# EAGLE board BMS (EAGLE 6.4), part 1 of 2
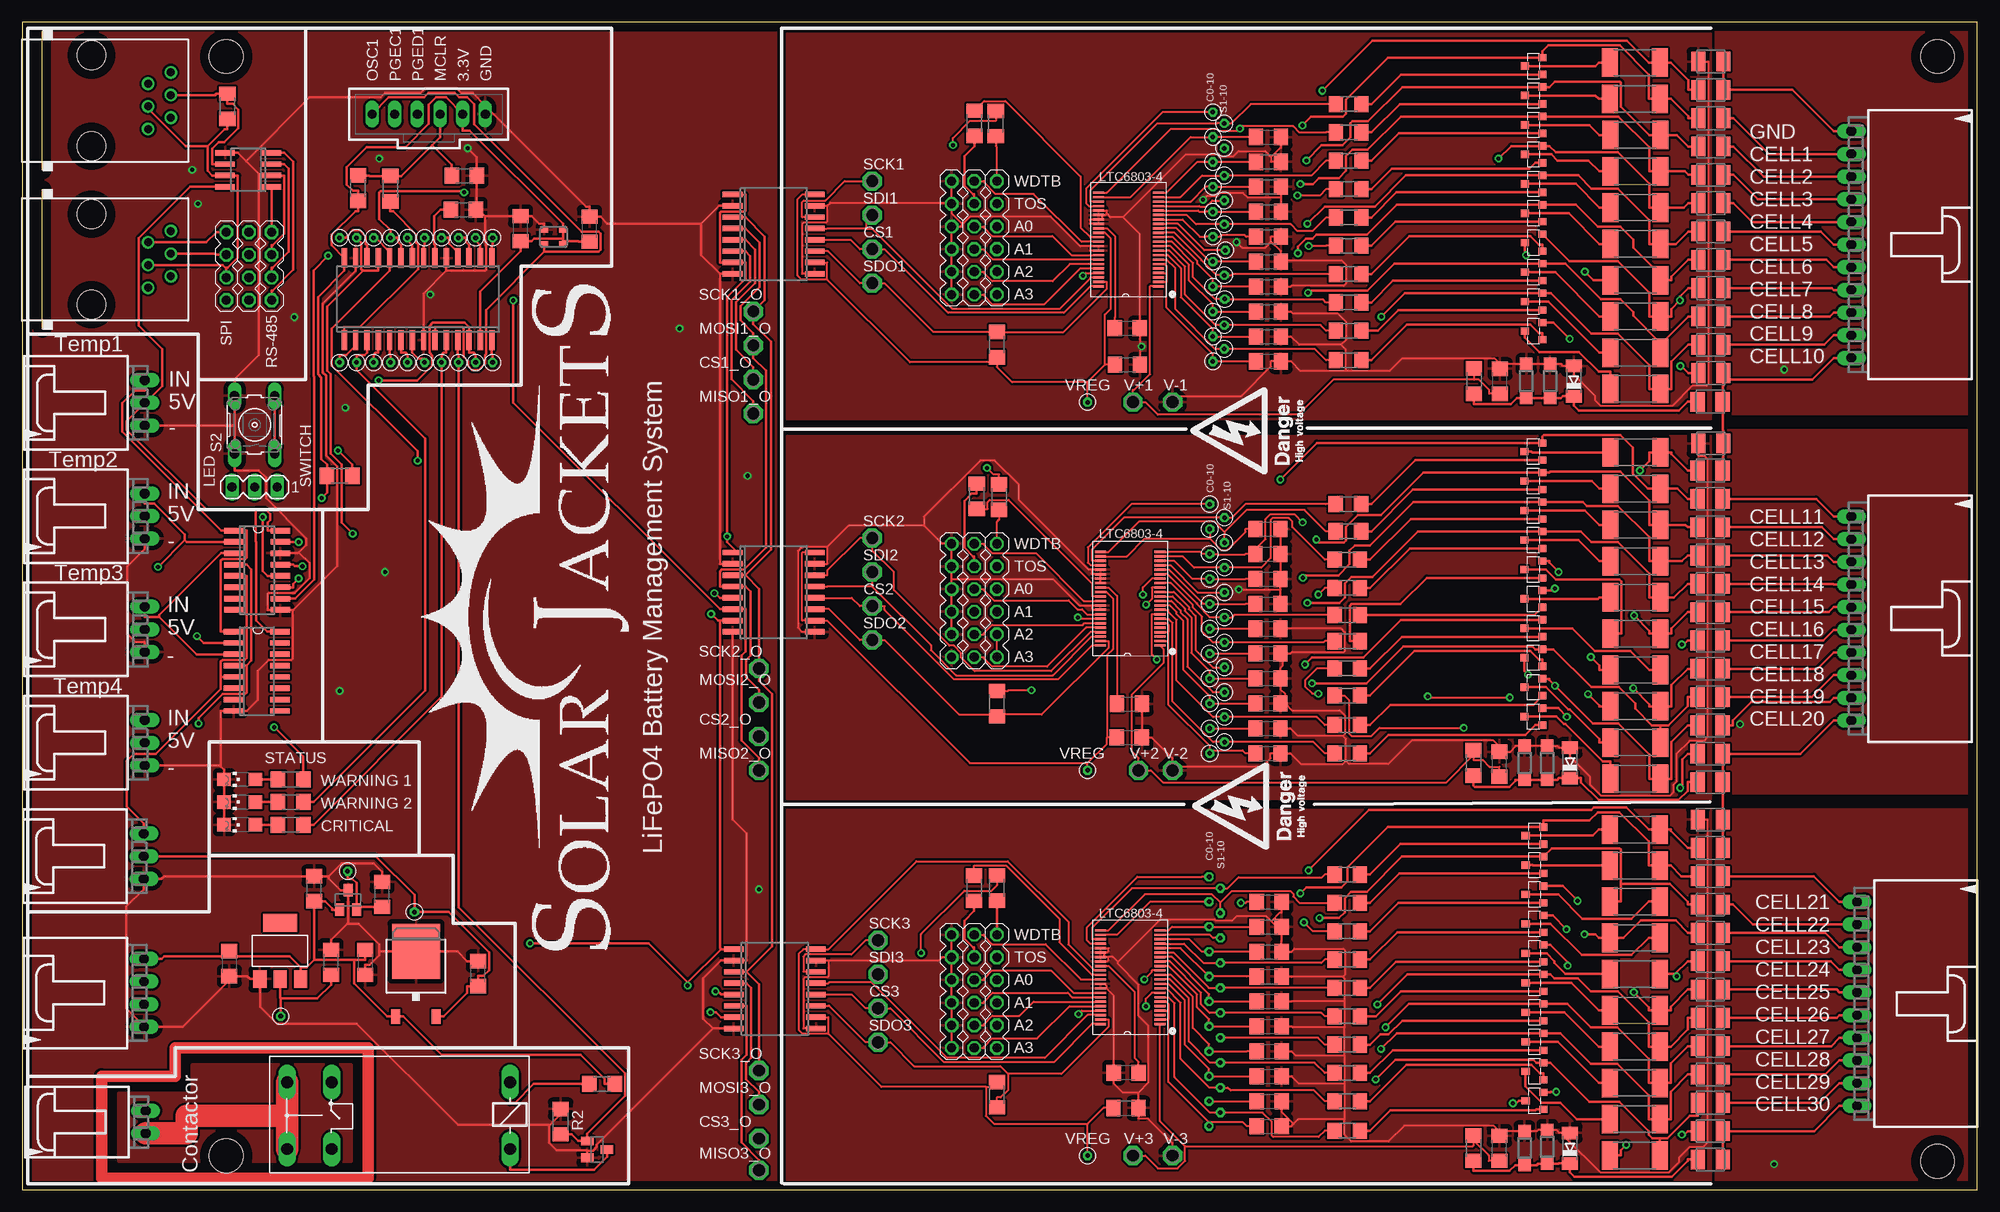
[diagram p10: board, top side]
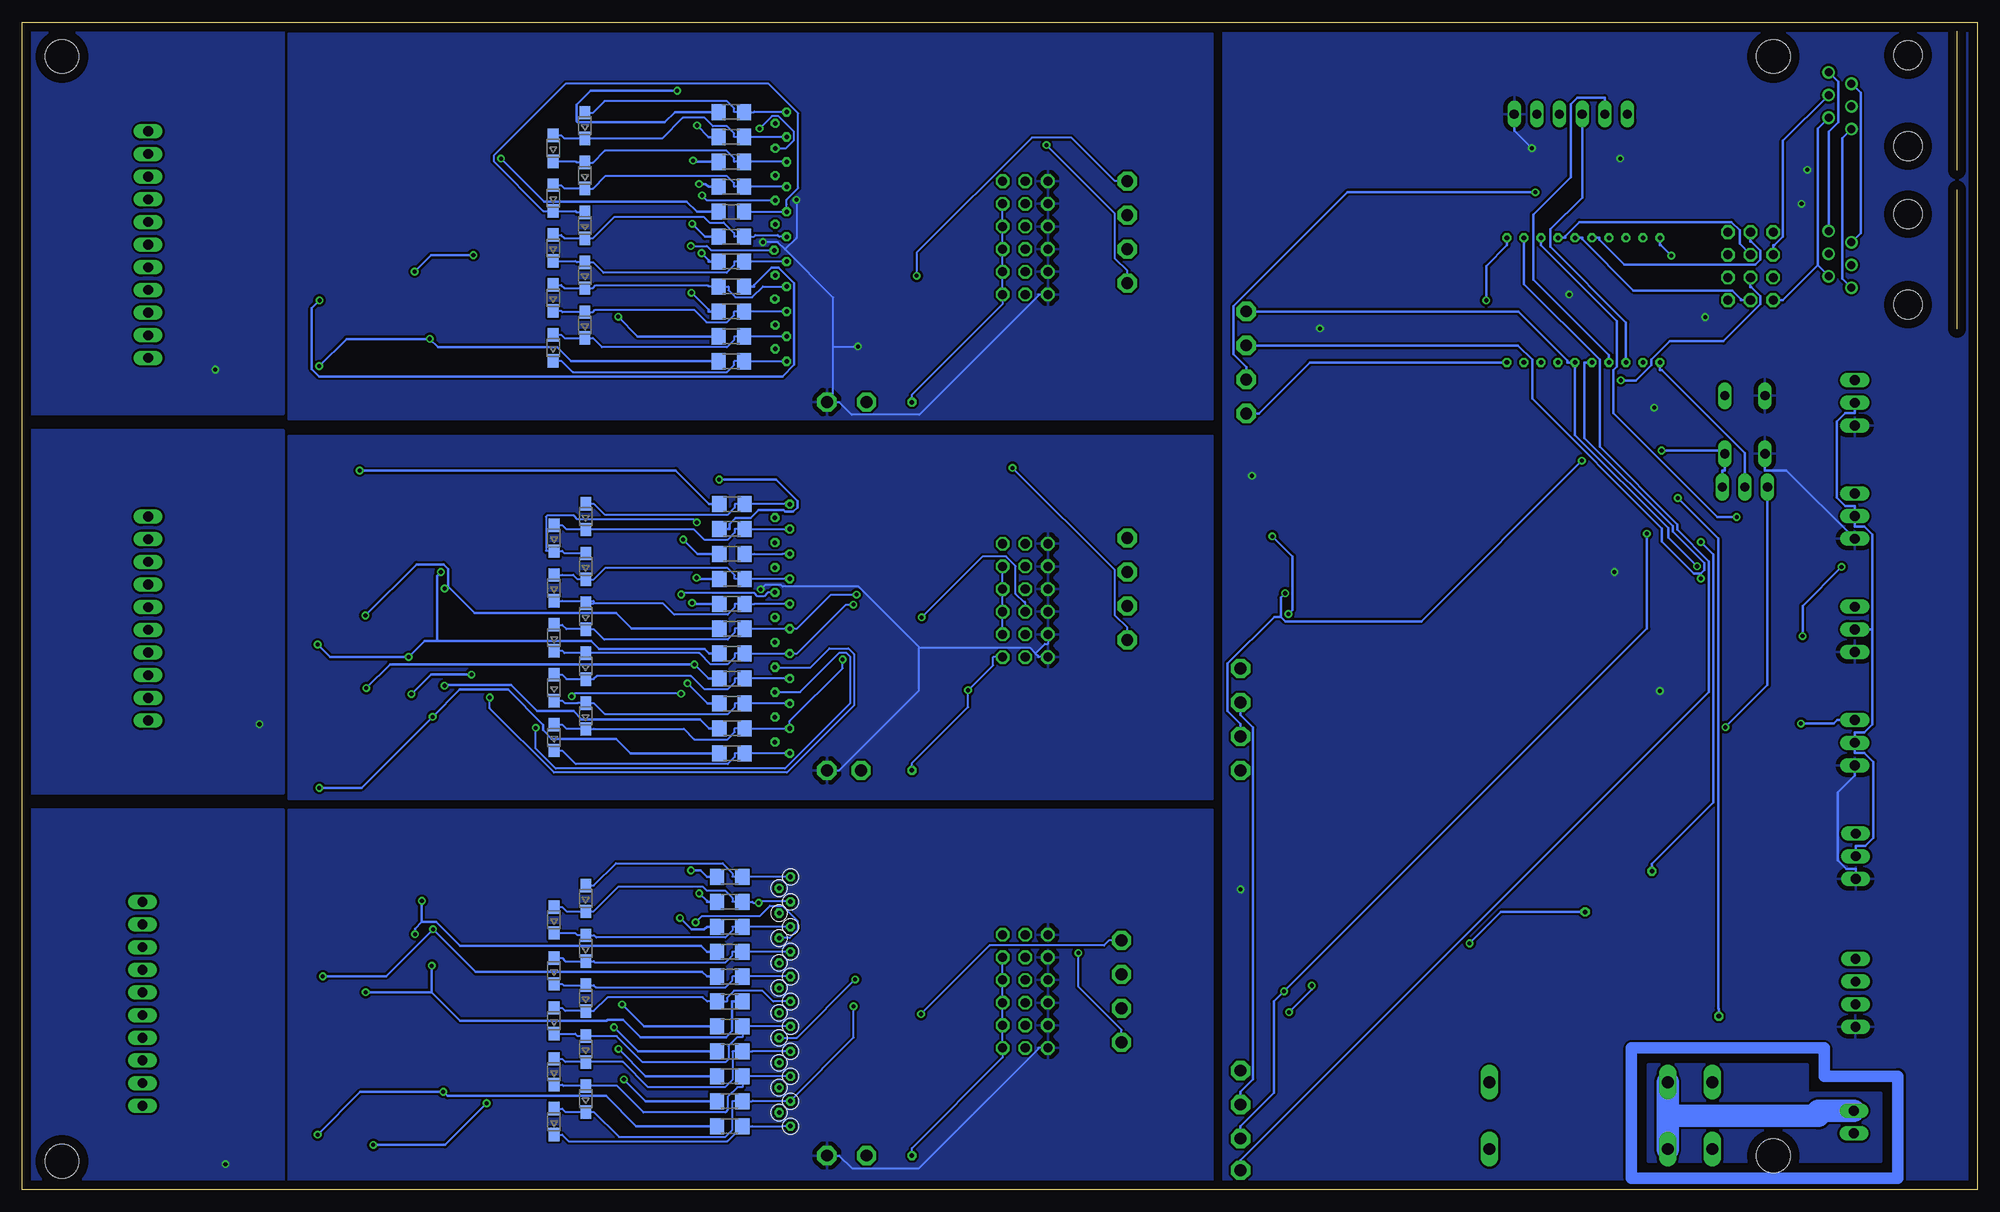
[diagram p11: board, bottom side, seen from below]

Size 219.07 x 130.84 mm. Coordinates in mm from the lower left corner, seen from the top.
Outline: 0,0 219.07,0 219.07,130.84 0,130.84 0,0
Copper layers (1*16): Top 0.035mm / dielectric 1.5mm / Bottom 0.035mm
Design rules "SJ Design Rules *": minimum track width 8mil, minimum drill 18mil, track to track 10mil, track to pad 8mil, pad to pad 8mil, via to via 10mil, smd to smd 8mil, copper to edge 40mil, drill to drill 10mil, minimum pad ring 10mil, minimum via ring 8mil, stop-mask expansion 4mil, vias tented up to drill 0mil, thermal gap 20mil
Net classes: 0 default: width 0.254 mm; 1 Mini: width 0.203 mm
Holes 3.81 mm at 214.63,127 214.63,3.17 22.86,3.81 22.86,127
tRestrict: 5 lines
bRestrict: 4 lines
vRestrict: area 130.3,38.6 to 144.2,47.5; area 130.8,80.2 to 143.8,89.8; area 67.9,62.5 to 68,63.2; area 67.8,62.5 to 67.9,63.4; area 67.7,62.5 to 67.8,63.6; area 67.7,62.5 to 67.7,63.7; area 67.6,62.5 to 67.7,63.8; area 67.5,62.5 to 67.6,63.9; area 67.4,62.5 to 67.5,64; area 67.3,62.5 to 67.4,64.1; area 67.3,62.5 to 67.3,64.2; area 67.2,62.5 to 67.3,63; 2520 more areas

## Footprints (pad centres in the part's own frame; a part is rotated, then mirrored left to right if it is on the bottom)
70553-04 = drill 1.092 long: 1 -3.81,-7.62; 2 -1.27,-7.62; 3 1.27,-7.62; 4 3.81,-7.62
70553-03 = drill 1.092 long: 1 -2.54,-7.62; 2 0,-7.62; 3 2.54,-7.62
C1206 = smd 1.6 x 1.8: 1 -1.4,0; 2 1.4,0
70553-10 = drill 1.092 long: 1 -11.43,-7.62; 2 -8.89,-7.62; 3 -6.35,-7.62; 4 -3.81,-7.62; 5 -1.27,-7.62; 6 1.27,-7.62; 7 3.81,-7.62; 8 6.35,-7.62; 9 8.89,-7.62; 10 11.43,-7.62
70553-02 = drill 1.092 long: 1 -1.27,-7.62; 2 1.27,-7.62
P1-13 = drill 1.321 pad 2.159 octagon: TP 0,0
SOD323-W = smd 1.5 x 1.2: A 1.45,0; C -1.45,0
MINIMELF = smd 1.4 x 1.8: A 1.7,0; C -1.7,0
SOD123 = smd 1.4 x 1.4: A 1.9,0; C -1.9,0
70553-11 = drill 1.092 long: 1 -12.7,-7.62; 2 -10.16,-7.62; 3 -7.62,-7.62; 4 -5.08,-7.62; 5 -2.54,-7.62; 6 0,-7.62; 7 2.54,-7.62; 8 5.08,-7.62; 9 7.62,-7.62; 10 10.16,-7.62; 11 12.7,-7.62
SO16W = smd 0.6 x 2.2: 1 -4.445,-4.6; 2 -3.175,-4.6; 3 -1.905,-4.6; 4 -0.635,-4.6; 5 0.635,-4.6; 6 1.905,-4.6; 7 3.175,-4.6; 8 4.445,-4.6; 9 4.445,4.6; 10 3.175,4.6; 11 1.905,4.6; 12 0.635,4.6; 13 -0.635,4.6; 14 -1.905,4.6; 15 -3.175,4.6; 16 -4.445,4.6
TO252 = smd 1 x 1.6: 1 -2.28,-4.8; 2 2.28,-4.8 | smd 5.4 x 6.2: 3 0,2.5
SOT223 = smd 1.499 x 2.007: 1 -2.261,-3.15; 2 0.025,-3.15; 3 2.311,-3.15 | smd 3.81 x 2.007: 4 0,3.15
RJ11-NO_SHIELD = drill 0.9 pad 1.4: 1 -3.175,8.89; 2 -1.905,6.35; 3 -0.635,8.89; 4 0.635,6.35; 5 1.905,8.89; 6 3.175,6.35 | hole 3.251: -5.08,0; 5.08,0
G2REA = drill 1.321 long: 1 -2.54,-3.683; 2 -2.54,3.81; P 17.45,-3.683; P@ 17.45,3.81; S 22.454,-3.683; S@ 22.454,3.81
L3225M = smd 1.6 x 2.2: 1 -1.4,0; 2 1.4,0
CHIPLED_1206 = smd 1.5 x 1.5: A 0,-1.75; C 0,1.75
SSOP44 = smd 0.25 x 1.25: P$1 -5.82,-3.33; P$2 -5.32,-3.33; P$3 -4.82,-3.33; P$4 -4.32,-3.33; P$5 -3.82,-3.33; P$6 -3.32,-3.33; P$7 -2.82,-3.33; P$8 -2.32,-3.33; P$9 -1.82,-3.33; P$10 -1.32,-3.33; P$11 -0.82,-3.33; P$12 -0.32,-3.33; P$13 0.18,-3.33; P$14 0.68,-3.33; P$15 1.18,-3.33; P$16 1.68,-3.33; P$17 2.18,-3.33; P$18 2.68,-3.33; P$19 3.18,-3.33; P$20 3.68,-3.33; P$21 4.18,-3.33; P$22 4.68,-3.33; P$23 4.68,3.37; P$24 4.18,3.37; P$25 3.68,3.37; P$26 3.18,3.37; P$27 2.68,3.37; P$28 2.18,3.37; P$29 1.68,3.37; P$30 1.18,3.37; P$31 0.68,3.37; P$32 0.18,3.37; P$33 -0.32,3.37; P$34 -0.82,3.37; P$35 -1.32,3.37; P$36 -1.82,3.37; P$37 -2.32,3.37; P$38 -2.82,3.37; P$39 -3.32,3.37; P$40 -3.82,3.37; P$41 -4.32,3.37; P$42 -4.82,3.37; P$43 -5.32,3.37; P$44 -5.82,3.37
20MIL = drill 0.508 octagon: P$1 0,0
70543-06 = drill 1.016 long: 1 -6.35,0; 2 -3.81,0; 3 -1.27,0; 4 1.27,0; 5 3.81,0; 6 6.35,0
MICRO3 = smd 0.8 x 0.9: 1 -0.95,-1; 2 0.95,-1; 3 0,1
R1206 = smd 1.6 x 1.803: 1 -1.422,0; 2 1.422,0
R2512 = smd 1.8 x 3.2: 1 -2.8,0; 2 2.8,0
B3F-10XX = drill 1.016 long: 1 -3.251,2.261; 2 3.251,2.261; 3 -3.251,-2.261; 4 3.251,-2.261
MA03-1 = drill 1.016 long: 1 -2.54,0; 2 0,0; 3 2.54,0
SOT23 = smd 1 x 1.4: 1 -0.95,-1.1; 2 0.95,-1.1; 3 0,1.1
SO16 = smd 0.6 x 2.2: 1 -4.445,-2.6; 2 -3.175,-2.6; 3 -1.905,-2.6; 4 -0.635,-2.6; 5 0.635,-2.6; 6 1.905,-2.6; 7 3.175,-2.6; 8 4.445,-2.6; 9 4.445,2.6; 10 3.175,2.6; 11 1.905,2.6; 12 0.635,2.6; 13 -0.635,2.6; 14 -1.905,2.6; 15 -3.175,2.6; 16 -4.445,2.6
SO28W = smd 0.6 x 2.2: 1 -8.255,-4.6; 2 -6.985,-4.6; 3 -5.715,-4.6; 4 -4.445,-4.6; 5 -3.175,-4.6; 6 -1.905,-4.6; 7 -0.635,-4.6; 8 0.635,-4.6; 9 1.905,-4.6; 10 3.175,-4.6; 11 4.445,-4.6; 12 5.715,-4.6; 13 6.985,-4.6; 14 8.255,-4.6; 15 8.255,4.6; 16 6.985,4.6; 17 5.715,4.6; 18 4.445,4.6; 19 3.175,4.6; 20 1.905,4.6; 21 0.635,4.6; 22 -0.635,4.6; 23 -1.905,4.6; 24 -3.175,4.6; 25 -4.445,4.6; 26 -5.715,4.6; 27 -6.985,4.6; 28 -8.255,4.6
ASE = smd 0.9 x 0.65: 1 -1.05,-0.825; 2 1.05,-0.825; 3 1.05,0.825; 4 -1.05,0.825
SO-08 = smd 0.6 x 2.2: 1 -1.905,-2.6; 2 -0.635,-2.6; 3 0.635,-2.6; 4 1.905,-2.6; 5 1.905,2.6; 6 0.635,2.6; 7 -0.635,2.6; 8 -1.905,2.6
3ROW_4POS = drill 1.016 octagon: 1 0,0; 2 2.54,0; 3 5.08,0; 4 0,-2.54; 5 2.54,-2.54; 6 5.08,-2.54; 7 0,-5.08; 8 2.54,-5.08; 9 5.08,-5.08; 10 0,-7.62; 11 2.54,-7.62; 12 5.08,-7.62
3ROW_6POS = drill 1.016 octagon: 1 0,0; 2 2.54,0; 3 5.08,0; 4 0,-2.54; 5 2.54,-2.54; 6 5.08,-2.54; 7 0,-5.08; 8 2.54,-5.08; 9 5.08,-5.08; 10 0,-7.62; 11 2.54,-7.62; 12 5.08,-7.62; 13 0,-10.16; 14 2.54,-10.16; 15 5.08,-10.16; 16 0,-12.7; 17 2.54,-12.7; 18 5.08,-12.7

## Placement (x,y rotation side)
12V  C-GRID-04-70553  [70553-04]  6.02,22.05 90 top
AIN0  C-GRID-03-70553  [70553-03]  6.1,88.19 90 top
AIN1  C-GRID-03-70553  [70553-03]  6.1,75.49 90 top
AIN2  C-GRID-03-70553  [70553-03]  6.1,62.79 90 top
AIN3  C-GRID-03-70553  [70553-03]  6.1,50.09 90 top
AIN4  C-GRID-03-70553  [70553-03]  5.99,37.36 90 top
C1  1uF  [C1206]  49.53,113.67 0 top
C2  1uF  [C1206]  123.85,92.46 0 top
C4  100nF 100V  [C1206]  139.65,92.84 0 top
C5  100nF 100V  [C1206]  139.65,95.63 0 top
C6  100nF 100V  [C1206]  139.65,98.42 0 top
C7  100nF 100V  [C1206]  139.65,101.22 0 top
C8  100nF 100V  [C1206]  139.65,104.01 0 top
C9  100nF 100V  [C1206]  139.65,106.81 0 top
C10  100nF 100V  [C1206]  139.65,109.6 0 top
C11  100nF 100V  [C1206]  139.65,112.39 0 top
C12  100nF 100V  [C1206]  139.65,115.19 0 top
C13  100nF 100V  [C1206]  139.65,117.98 0 top
C14  100nF 100V  [C1206]  165.61,90.6 90 top
C15  1uF  [C1206]  123.83,96.55 0 top
C16  .1uF  [C1206]  55.83,107.7 90 top
C19  100nF 100V  [C1206]  139.6,48.9 0 top
C20  100nF 100V  [C1206]  139.6,51.69 0 top
C21  100nF 100V  [C1206]  139.6,54.48 0 top
C22  4.7uF  [C1206]  49.43,109.86 0 top
C23  100nF 100V  [C1206]  139.6,57.28 0 top
C24  100nF 100V  [C1206]  139.6,60.07 0 top
C25  100nF 100V  [C1206]  139.6,62.87 0 top
C26  100nF 100V  [C1206]  139.6,65.66 0 top
C27  100nF 100V  [C1206]  139.6,68.45 0 top
C28  100nF 100V  [C1206]  139.6,71.25 0 top
C29  100nF 100V  [C1206]  139.6,74.04 0 top
C30  100nF 100V  [C1206]  165.53,47.68 90 top
C31  1uF  [C1206]  124.05,50.67 0 top
C32  1uF  [C1206]  124.08,54.46 0 top
C35  100nF 100V  [C1206]  139.73,7.11 0 top
C36  100nF 100V  [C1206]  139.73,9.91 0 top
C37  100nF 100V  [C1206]  139.73,12.7 0 top
C38  100nF 100V  [C1206]  139.73,15.49 0 top
C39  100nF 100V  [C1206]  139.73,18.29 0 top
C40  100nF 100V  [C1206]  139.73,21.08 0 top
C41  100nF 100V  [C1206]  139.73,23.88 0 top
C42  100nF 100V  [C1206]  139.73,26.67 0 top
C43  100nF 100V  [C1206]  139.73,29.46 0 top
C44  100nF 100V  [C1206]  139.73,32.26 0 top
C45  100nF 100V  [C1206]  165.53,4.62 90 top
C46  1uF  [C1206]  123.67,9.14 0 top
C47  1uF  [C1206]  123.7,13.11 180 top
C48  .1uF  [C1206]  63.55,107.65 90 top
C49  .1uF  [C1206]  40.31,33.1 90 top
C50  1uF  [C1206]  32.69,33.73 90 top
C51  1uF  [C1206]  23.19,25.32 270 top
C52  .1uF  [C1206]  34.59,25.48 90 top
C53  1uF  [C1206]  38.4,25.48 270 top
C54  .1uF  [C1206]  51.1,24.21 90 top
CELLS-11-20  C-GRID-10-70553  [70553-10]  212.6,64.01 270 top
CELLS-21-30  C-GRID-10-70553  [70553-10]  213.23,20.83 270 top
CONTACTOR  C-GRID-02-70553  [70553-02]  6.2,7.57 90 top
CS1  PTR1PAD1-13  [P1-13]  95.25,105.41 0 top
CS1_O  PTR1PAD1-13  [P1-13]  81.92,90.81 0 top
CS2  PTR1PAD1-13  [P1-13]  95.25,65.41 0 top
CS2_O  PTR1PAD1-13  [P1-13]  82.55,50.8 0 top
CS3  PTR1PAD1-13  [P1-13]  95.89,20.32 0 top
CS3_O  PTR1PAD1-13  [P1-13]  82.55,5.71 0 top
D4  PDZ7.5B  [SOD323-W]  159.49,50.67 90 bottom
D6  PDZ7.5B  [SOD323-W]  159.59,94.36 90 bottom
D7  PDZ7.5B  [SOD323-W]  156.03,96.9 90 bottom
D8  PDZ7.5B  [SOD323-W]  159.59,99.95 90 bottom
D9  PDZ7.5B  [SOD323-W]  156.03,102.49 90 bottom
D10  PDZ7.5B  [SOD323-W]  159.59,105.54 90 bottom
D11  PDZ7.5B  [SOD323-W]  156.03,108.08 90 bottom
D12  PDZ7.5B  [SOD323-W]  159.59,111.12 90 bottom
D13  PDZ7.5B  [SOD323-W]  156.03,113.67 90 bottom
D14  PDZ7.5B  [SOD323-W]  159.59,116.71 90 bottom
D15  PDZ7.5B  [SOD323-W]  156.03,119.25 90 bottom
D16  ZMM5265B-7  [MINIMELF]  173.86,90.63 90 top
D17  BAT46W  [SOD123]  171.2,90.63 90 top
D18  BAT46W  [SOD123]  168.53,90.63 90 top
D19  PDZ7.5B  [SOD323-W]  155.93,53.09 90 bottom
D20  PDZ7.5B  [SOD323-W]  159.49,56.26 90 bottom
D21  PDZ7.5B  [SOD323-W]  155.93,58.67 90 bottom
D22  PDZ7.5B  [SOD323-W]  159.49,61.85 90 bottom
D23  PDZ7.5B  [SOD323-W]  155.93,64.26 90 bottom
D24  PDZ7.5B  [SOD323-W]  159.49,67.44 90 bottom
D25  PDZ7.5B  [SOD323-W]  155.93,69.85 90 bottom
D26  PDZ7.5B  [SOD323-W]  159.49,73.03 90 bottom
D27  PDZ7.5B  [SOD323-W]  155.93,75.44 90 bottom
D28  ZMM5265B-7  [MINIMELF]  173.43,47.83 90 top
D29  BAT46W  [SOD123]  170.89,47.83 90 top
D30  BAT46W  [SOD123]  168.35,47.83 90 top
D33  PDZ7.5B  [SOD323-W]  159.49,7.62 90 bottom
D34  PDZ7.5B  [SOD323-W]  155.93,10.16 90 bottom
D35  PDZ7.5B  [SOD323-W]  159.49,13.21 90 bottom
D36  PDZ7.5B  [SOD323-W]  155.93,15.75 90 bottom
D37  PDZ7.5B  [SOD323-W]  159.49,18.92 90 bottom
D38  PDZ7.5B  [SOD323-W]  155.93,21.46 90 bottom
D39  PDZ7.5B  [SOD323-W]  159.49,24.51 90 bottom
D40  PDZ7.5B  [SOD323-W]  155.93,27.05 90 bottom
D41  PDZ7.5B  [SOD323-W]  159.49,30.23 90 bottom
D42  PDZ7.5B  [SOD323-W]  155.93,32.64 90 bottom
D43  ZMM5265B-7  [MINIMELF]  173.43,4.65 90 top
D44  BAT46W  [SOD123]  168.35,4.65 90 top
D45  BAT46W  [SOD123]  170.89,4.8 90 top
GND-10  C-GRID-11-70553  [70553-11]  212.6,105.92 270 top
IC1  ADUM1401  [SO16W]  84.2,107.09 270 top
IC2  7805DT  [TO252]  44.12,24.21 0 top
IC2_\  ADUM1401  [SO16W]  84.2,66.95 270 top
IC3  REG1117  [SOT223]  28.88,26.75 0 top
IC3_  ADUM1401  [SO16W]  84.33,22.5 270 top
J19  RJ11-2L-B  [RJ11-NO_SHIELD]  7.75,122.05 270 top
J20  RJ11-2L-B  [RJ11-NO_SHIELD]  7.75,104.27 270 top
K1  G2REA  [G2REA]  52.12,8.36 180 top
L5  IMC1210ER100K  [L3225M]  189.23,91.52 180 top
L6  IMC1210ER100K  [L3225M]  189.23,94.69 180 top
L7  IMC1210ER100K  [L3225M]  189.23,97.87 180 top
L8  IMC1210ER100K  [L3225M]  189.23,101.04 180 top
L9  IMC1210ER100K  [L3225M]  189.23,104.22 180 top
L10  IMC1210ER100K  [L3225M]  189.23,107.39 180 top
L11  IMC1210ER100K  [L3225M]  189.23,110.57 180 top
L12  IMC1210ER100K  [L3225M]  189.23,113.74 180 top
L13  IMC1210ER100K  [L3225M]  189.23,116.92 180 top
L14  IMC1210ER100K  [L3225M]  189.23,120.09 180 top
L15  IMC1210ER100K  [L3225M]  189.15,88.32 180 top
L16  IMC1210ER100K  [L3225M]  189.23,126.44 180 top
L17  IMC1210ER100K  [L3225M]  189.23,123.27 180 top
L18  IMC1210ER100K  [L3225M]  189.15,48.84 180 top
L19  IMC1210ER100K  [L3225M]  189.15,52.02 180 top
L20  IMC1210ER100K  [L3225M]  189.15,55.19 180 top
L21  IMC1210ER100K  [L3225M]  189.15,58.37 180 top
L22  IMC1210ER100K  [L3225M]  189.15,61.54 180 top
L23  IMC1210ER100K  [L3225M]  189.15,64.72 180 top
L24  IMC1210ER100K  [L3225M]  189.15,67.89 180 top
L25  IMC1210ER100K  [L3225M]  189.15,71.07 180 top
L26  IMC1210ER100K  [L3225M]  189.15,74.24 180 top
L27  IMC1210ER100K  [L3225M]  189.15,77.42 180 top
L28  IMC1210ER100K  [L3225M]  189.15,45.67 180 top
L29  IMC1210ER100K  [L3225M]  189.23,83.64 180 top
L30  IMC1210ER100K  [L3225M]  189.15,80.59 180 top
L33  IMC1210ER100K  [L3225M]  189.18,6.55 180 top
L34  IMC1210ER100K  [L3225M]  189.18,9.73 180 top
L35  IMC1210ER100K  [L3225M]  189.18,12.9 180 top
L36  IMC1210ER100K  [L3225M]  189.18,16.08 180 top
L37  IMC1210ER100K  [L3225M]  189.18,19.25 180 top
L38  IMC1210ER100K  [L3225M]  189.18,22.43 180 top
L39  IMC1210ER100K  [L3225M]  189.18,25.6 180 top
L40  IMC1210ER100K  [L3225M]  189.18,28.78 180 top
L41  IMC1210ER100K  [L3225M]  189.18,31.95 180 top
L42  IMC1210ER100K  [L3225M]  189.18,35.13 180 top
L43  IMC1210ER100K  [L3225M]  189.18,3.38 180 top
L44  IMC1210ER100K  [L3225M]  189.18,41.48 180 top
L45  IMC1210ER100K  [L3225M]  189.18,38.3 180 top
LED37  YELLOW  [CHIPLED_1206]  24.36,43.43 90 top
LED38  RED  [CHIPLED_1206]  24.36,40.89 90 top
LED40  YELLOW  [CHIPLED_1206]  24.36,45.97 90 top
LTC1  LTC6803-4  [SSOP44]  123.98,107.06 90 top
LTC1_C0  TESTPAD-20MIL  [20MIL]  133.43,120.78 90 top
LTC1_C1  TESTPAD-20MIL  [20MIL]  133.43,117.98 90 top
LTC1_C2  TESTPAD-20MIL  [20MIL]  133.43,115.19 90 top
LTC1_C3  TESTPAD-20MIL  [20MIL]  133.43,112.39 90 top
LTC1_C4  TESTPAD-20MIL  [20MIL]  133.43,109.6 90 top
LTC1_C5  TESTPAD-20MIL  [20MIL]  133.43,106.81 90 top
LTC1_C6  TESTPAD-20MIL  [20MIL]  133.43,104.01 90 top
LTC1_C7  TESTPAD-20MIL  [20MIL]  133.43,101.22 90 top
LTC1_C8  TESTPAD-20MIL  [20MIL]  133.43,98.42 90 top
LTC1_C9  TESTPAD-20MIL  [20MIL]  133.43,95.63 90 top
LTC1_C10  TESTPAD-20MIL  [20MIL]  133.43,92.84 90 top
LTC1_S1  TESTPAD-20MIL  [20MIL]  134.7,119.51 90 top
LTC1_S2  TESTPAD-20MIL  [20MIL]  134.7,116.71 90 top
LTC1_S3  TESTPAD-20MIL  [20MIL]  134.7,113.67 90 top
LTC1_S4  TESTPAD-20MIL  [20MIL]  134.7,110.87 90 top
LTC1_S5  TESTPAD-20MIL  [20MIL]  134.7,108.2 90 top
LTC1_S6  TESTPAD-20MIL  [20MIL]  134.82,105.28 90 top
LTC1_S7  TESTPAD-20MIL  [20MIL]  134.7,102.49 90 top
LTC1_S8  TESTPAD-20MIL  [20MIL]  134.75,99.82 90 top
LTC1_S9  TESTPAD-20MIL  [20MIL]  134.7,96.9 90 top
LTC1_S10  TESTPAD-20MIL  [20MIL]  134.7,94.23 90 top
LTC2  LTC6803-4  [SSOP44]  124.18,66.8 90 top
LTC2_C0  TESTPAD-20MIL  [20MIL]  133.07,76.83 90 top
LTC2_C1  TESTPAD-20MIL  [20MIL]  133.07,74.04 90 top
LTC2_C2  TESTPAD-20MIL  [20MIL]  133.07,71.25 90 top
LTC2_C3  TESTPAD-20MIL  [20MIL]  133.07,68.45 90 top
LTC2_C4  TESTPAD-20MIL  [20MIL]  133.07,65.66 90 top
LTC2_C5  TESTPAD-20MIL  [20MIL]  133.07,62.87 90 top
LTC2_C6  TESTPAD-20MIL  [20MIL]  133.07,60.07 90 top
LTC2_C7  TESTPAD-20MIL  [20MIL]  133.07,57.28 90 top
LTC2_C8  TESTPAD-20MIL  [20MIL]  133.07,54.48 90 top
LTC2_C9  TESTPAD-20MIL  [20MIL]  133.07,51.69 90 top
LTC2_C10  TESTPAD-20MIL  [20MIL]  133.07,48.9 90 top
LTC2_S1  TESTPAD-20MIL  [20MIL]  134.72,75.31 90 top
LTC2_S2  TESTPAD-20MIL  [20MIL]  134.72,72.52 90 top
LTC2_S3  TESTPAD-20MIL  [20MIL]  134.72,69.72 90 top
LTC2_S4  TESTPAD-20MIL  [20MIL]  134.72,66.93 90 top
LTC2_S5  TESTPAD-20MIL  [20MIL]  134.72,64.14 90 top
LTC2_S6  TESTPAD-20MIL  [20MIL]  134.72,61.34 90 top
LTC2_S7  TESTPAD-20MIL  [20MIL]  134.72,58.55 90 top
LTC2_S8  TESTPAD-20MIL  [20MIL]  134.72,55.75 90 top
LTC2_S9  TESTPAD-20MIL  [20MIL]  134.72,52.96 90 top
LTC2_S10  TESTPAD-20MIL  [20MIL]  134.72,50.16 90 top
LTC3  LTC6803-4  [SSOP44]  124.18,24.38 90 top
LTC3_C0  TESTPAD-20MIL  [20MIL]  132.99,35.05 90 bottom
LTC3_C1  TESTPAD-20MIL  [20MIL]  132.99,32.26 90 bottom
LTC3_C2  TESTPAD-20MIL  [20MIL]  132.99,29.46 90 bottom
LTC3_C3  TESTPAD-20MIL  [20MIL]  132.99,26.67 90 bottom
LTC3_C4  TESTPAD-20MIL  [20MIL]  132.99,23.88 90 bottom
LTC3_C5  TESTPAD-20MIL  [20MIL]  132.99,21.08 90 bottom
LTC3_C6  TESTPAD-20MIL  [20MIL]  132.99,18.29 90 bottom
LTC3_C7  TESTPAD-20MIL  [20MIL]  132.99,15.49 90 bottom
LTC3_C8  TESTPAD-20MIL  [20MIL]  132.99,12.7 90 bottom
LTC3_C9  TESTPAD-20MIL  [20MIL]  132.99,9.91 90 bottom
LTC3_C10  TESTPAD-20MIL  [20MIL]  132.99,7.11 90 bottom
LTC3_S1  TESTPAD-20MIL  [20MIL]  134.26,33.78 90 bottom
LTC3_S2  TESTPAD-20MIL  [20MIL]  134.26,30.99 90 bottom
LTC3_S3  TESTPAD-20MIL  [20MIL]  134.26,28.19 90 bottom
LTC3_S4  TESTPAD-20MIL  [20MIL]  134.26,25.4 90 bottom
LTC3_S5  TESTPAD-20MIL  [20MIL]  134.26,22.61 90 bottom
LTC3_S6  TESTPAD-20MIL  [20MIL]  134.26,19.81 90 bottom
LTC3_S7  TESTPAD-20MIL  [20MIL]  134.26,17.02 90 bottom
LTC3_S8  TESTPAD-20MIL  [20MIL]  134.26,14.22 90 bottom
LTC3_S9  TESTPAD-20MIL  [20MIL]  134.26,11.43 90 bottom
LTC3_S10  TESTPAD-20MIL  [20MIL]  134.26,8.64 90 bottom
MISO1_O  PTR1PAD1-13  [P1-13]  81.92,87 0 top
MISO2_O  PTR1PAD1-13  [P1-13]  82.55,46.99 0 top
MISO3_O  PTR1PAD1-13  [P1-13]  82.55,2.16 0 top
MOSI1_O  PTR1PAD1-13  [P1-13]  81.92,94.61 0 top
MOSI2_O  PTR1PAD1-13  [P1-13]  82.55,54.61 0 top
MOSI3_O  PTR1PAD1-13  [P1-13]  82.55,9.53 0 top
PROGRAM  C-GRID-06-70543  [70543-06]  45.54,120.55 0 top
Q3  SI2351DS  [MICRO3]  169.37,96.22 90 top
Q4  SI2351DS  [MICRO3]  169.37,99.52 90 top
Q5  SI2351DS  [MICRO3]  169.37,102.82 90 top
Q6  SI2351DS  [MICRO3]  169.37,106.12 90 top
Q7  SI2351DS  [MICRO3]  169.37,109.42 90 top
Q8  SI2351DS  [MICRO3]  169.37,112.73 90 top
Q9  SI2351DS  [MICRO3]  169.37,116.03 90 top
Q10  SI2351DS  [MICRO3]  169.37,119.33 90 top
Q11  SI2351DS  [MICRO3]  169.37,122.63 90 top
Q12  SI2351DS  [MICRO3]  169.37,125.93 90 top
Q15  SI2351DS  [MICRO3]  169.34,53.01 90 top
Q16  SI2351DS  [MICRO3]  169.34,56.31 90 top
Q17  SI2351DS  [MICRO3]  169.34,59.61 90 top
Q18  SI2351DS  [MICRO3]  169.34,62.92 90 top
Q19  SI2351DS  [MICRO3]  169.34,69.52 90 top
Q20  SI2351DS  [MICRO3]  169.34,66.22 90 top
Q21  SI2351DS  [MICRO3]  169.34,72.82 90 top
Q22  SI2351DS  [MICRO3]  169.34,76.12 90 top
Q23  SI2351DS  [MICRO3]  169.34,79.43 90 top
Q24  SI2351DS  [MICRO3]  169.34,82.73 90 top
Q27  SI2351DS  [MICRO3]  169.47,9.96 90 top
Q28  SI2351DS  [MICRO3]  169.47,13.26 90 top
Q29  SI2351DS  [MICRO3]  169.47,16.56 90 top
Q30  SI2351DS  [MICRO3]  169.47,19.86 90 top
Q31  SI2351DS  [MICRO3]  169.47,23.16 90 top
Q32  SI2351DS  [MICRO3]  169.47,26.47 90 top
Q33  SI2351DS  [MICRO3]  169.47,29.77 90 top
Q34  SI2351DS  [MICRO3]  169.47,33.07 90 top
Q35  SI2351DS  [MICRO3]  169.47,36.37 90 top
Q36  SI2351DS  [MICRO3]  169.47,39.67 90 top
R1  10K  [R1206]  35.56,80.01 180 top
R2  10K  [R1206]  60.33,7.62 270 top
R5  1M  [R1206]  106.71,119.51 270 top
R10  100 1%  [R1206]  139.62,92.84 0 bottom
R11  3.3K  [R1206]  148.64,92.96 180 top
R12  33 1W  [R2512]  180.77,89.74 180 top
R14  100 1%  [R1206]  139.62,95.63 0 bottom
R15  3.3K  [R1206]  148.64,96.27 180 top
R16  33 1W  [R2512]  180.77,93.8 180 top
R18  100 1%  [R1206]  139.62,98.42 0 bottom
R19  3.3K  [R1206]  148.64,99.44 180 top
R20  33 1W  [R2512]  180.77,97.87 180 top
R22  100 1%  [R1206]  139.62,101.22 180 bottom
R23  3.3K  [R1206]  148.64,102.62 180 top
R24  33 1W  [R2512]  180.77,101.93 180 top
R26  100 1%  [R1206]  139.62,104.01 0 bottom
R27  3.3K  [R1206]  148.64,105.79 180 top
R28  33 1W  [R2512]  180.77,105.99 180 top
R30  100 1%  [R1206]  139.62,106.81 0 bottom
R31  3.3K  [R1206]  148.64,108.97 180 top
R32  33 1W  [R2512]  180.77,110.06 180 top
R34  100 1%  [R1206]  139.62,109.6 0 bottom
R35  3.3K  [R1206]  148.64,112.14 180 top
R36  33 1W  [R2512]  180.77,114.12 180 top
R38  100 1%  [R1206]  139.62,112.39 0 bottom
R39  3.3K  [R1206]  148.64,115.32 180 top
R40  33 1W  [R2512]  180.77,118.19 180 top
R42  100 1%  [R1206]  139.62,115.19 0 bottom
R43  3.3K  [R1206]  148.64,118.49 180 top
R44  33 1W  [R2512]  180.72,122.25 180 top
R46  100 1%  [R1206]  139.62,117.98 0 bottom
R47  3.3K  [R1206]  148.64,121.67 180 top
R48  33 1W  [R2512]  180.72,126.31 180 top
R50  100  [R1206]  162.69,90.63 90 top
R51  100 1%  [R1206]  139.62,120.78 0 bottom
R52  10k\  [R1206]  37.62,112.24 90 top
R53  470  [R1206]  41.25,112.19 270 top
R62  100 1%  [R1206]  139.55,48.9 0 bottom
R63  3.3K  [R1206]  148.49,48.9 180 top
R64  33 1W  [R2512]  180.77,46.05 180 top
R66  100 1%  [R1206]  139.55,51.69 0 bottom
R67  3.3K  [R1206]  148.49,52.07 180 top
R68  33 1W  [R2512]  180.77,50.11 180 top
R70  100 1%  [R1206]  139.55,54.48 0 bottom
R71  3.3K  [R1206]  148.49,55.37 180 top
R72  33 1W  [R2512]  180.77,54.18 180 top
R74  100 1%  [R1206]  139.55,57.28 0 bottom
R75  3.3K  [R1206]  148.49,58.42 180 top
R76  33 1W  [R2512]  180.77,58.24 0 top
R78  100 1%  [R1206]  139.55,60.07 0 bottom
R79  3.3K  [R1206]  148.49,61.47 180 top
R80  33 1W  [R2512]  180.77,62.31 180 top
R82  100 1%  [R1206]  139.55,62.87 0 bottom
R83  3.3K  [R1206]  148.49,64.39 180 top
R84  33 1W  [R2512]  180.77,66.37 180 top
R86  100 1%  [R1206]  139.55,65.66 0 bottom
R87  3.3K  [R1206]  148.49,67.44 180 top
R88  33 1W  [R2512]  180.77,70.43 180 top
R90  100 1%  [R1206]  139.55,68.45 0 bottom
R91  3.3K  [R1206]  148.49,70.61 180 top
R92  33 1W  [R2512]  180.77,74.5 180 top
R94  100 1%  [R1206]  139.55,71.25 0 bottom
R95  3.3K  [R1206]  148.62,73.79 180 top
R96  33 1W  [R2512]  180.77,78.56 180 top
R98  100 1%  [R1206]  139.55,74.04 0 bottom
R99  3.3K  [R1206]  148.62,76.83 180 top
R100  33 1W  [R2512]  180.77,82.63 180 top
R102  100  [R1206]  162.64,47.83 90 top
R103  100 1%  [R1206]  139.55,76.83 0 bottom
R104  1M  [R1206]  106.96,77.72 90 top
R113  100 1%  [R1206]  139.8,7.11 0 bottom
R114  3.3K  [R1206]  148.49,6.6 180 top
R115  33 1W  [R2512]  180.7,3.84 180 top
R117  100 1%  [R1206]  139.8,9.91 0 bottom
R118  3.3K  [R1206]  148.49,9.91 180 top
R119  33 1W  [R2512]  180.7,7.9 180 top
R121  100 1%  [R1206]  139.8,12.7 0 bottom
R122  3.3K  [R1206]  148.49,13.08 180 top
R123  33 1W  [R2512]  180.7,11.96 180 top
R125  100 1%  [R1206]  139.8,15.49 0 bottom
R126  3.3K  [R1206]  148.49,16.26 180 top
R127  33 1W  [R2512]  180.7,16.03 180 top
R129  100 1%  [R1206]  139.8,18.29 0 bottom
R130  3.3K  [R1206]  148.49,19.43 180 top
R131  33 1W  [R2512]  180.7,20.09 180 top
R133  100 1%  [R1206]  139.8,21.08 180 bottom
R134  3.3K  [R1206]  148.49,22.61 180 top
R135  33 1W  [R2512]  180.7,24.16 180 top
R137  100 1%  [R1206]  139.8,23.88 0 bottom
R138  3.3K  [R1206]  148.49,25.78 180 top
R139  33 1W  [R2512]  180.7,28.22 0 top
R141  100 1%  [R1206]  139.8,26.67 0 bottom
R142  3.3K  [R1206]  148.49,28.96 180 top
R143  33 1W  [R2512]  180.7,32.28 0 top
R145  100 1%  [R1206]  139.8,29.46 0 bottom
R146  3.3K  [R1206]  148.49,32.13 180 top
R147  33 1W  [R2512]  180.7,36.32 180 top
R149  100 1%  [R1206]  139.8,32.26 0 bottom
R150  3.3K  [R1206]  148.49,35.31 180 top
R151  33 1W  [R2512]  180.7,40.36 180 top
R153  100  [R1206]  162.64,4.65 90 top
R154  100 1%  [R1206]  139.8,35.05 0 bottom
R155  1M  [R1206]  106.65,33.78 270 top
R156  62  [R1206]  30.07,40.89 0 top
R157  62  [R1206]  30.07,43.43 0 top
R158  62  [R1206]  30.07,45.97 0 top
R163  1M  [R1206]  109.22,10.64 270 top
R164  1M  [R1206]  109.22,33.81 90 top
R165  1M  [R1206]  109.22,54.46 270 top
R166  1M  [R1206]  109.47,77.62 90 top
R167  1M  [R1206]  109.22,94.72 90 top
R168  1M  [R1206]  109.09,119.48 90 top
R169  100  [R1206]  64.97,11.84 0 top
R170  120  [R1206]  22.99,121.41 270 top
S2  [B3F-10XX]  26.04,85.72 90 top
SCK1  PTR1PAD1-13  [P1-13]  95.25,113.03 0 top
SCK1_O  PTR1PAD1-13  [P1-13]  81.92,98.42 0 top
SCK2  PTR1PAD1-13  [P1-13]  95.25,73.03 0 top
SCK2_O  PTR1PAD1-13  [P1-13]  82.55,58.42 0 top
SCK3  PTR1PAD1-13  [P1-13]  95.89,27.94 0 top
SCK3_O  PTR1PAD1-13  [P1-13]  82.55,13.34 0 top
SDI1  PTR1PAD1-13  [P1-13]  95.25,109.22 0 top
SDI2  PTR1PAD1-13  [P1-13]  95.25,69.22 0 top
SDI3  PTR1PAD1-13  [P1-13]  95.89,24.13 0 top
SDO1  PTR1PAD1-13  [P1-13]  95.25,101.6 0 top
SDO2  PTR1PAD1-13  [P1-13]  95.25,61.59 0 top
SDO3  PTR1PAD1-13  [P1-13]  95.89,16.51 0 top
SV1  [MA03-1]  26.04,78.74 180 top
T1  PMV56XN  [SOT23]  64.41,4.5 270 top
U$1  SP720APP  [SO16]  26.29,58.09 270 top
U$2  PIC24HJ128GP-202  [SO28W]  44.35,99.82 0 top
U$3  ASE  [ASE]  59.54,106.78 180 top
U$4  MAX3440E  [SO-08]  25.32,114.3 90 top
U$5  3ROW_4POS  [3ROW_4POS]  22.86,107.31 0 top
U$6  MCP-3008  [SO16]  26.31,69.42 270 top
U$7  MAX6105  [SOT23]  36.5,32.46 0 top
U$8  3ROW_6POS  [3ROW_6POS]  104.14,113.03 0 top
U$9  3ROW_6POS  [3ROW_6POS]  104.14,72.39 0 top
U$10  3ROW_6POS  [3ROW_6POS]  104.14,28.57 0 top
U$11  TESTPAD-20MIL  [20MIL]  36.45,35.69 0 top
U$12  TESTPAD-20MIL  [20MIL]  28.96,19.43 0 top
U$13  TESTPAD-20MIL  [20MIL]  43.94,31.11 0 top
U$14  TESTPAD-20MIL  [20MIL]  35.56,92.71 0 top
U$15  TESTPAD-20MIL  [20MIL]  37.47,92.71 0 top
U$16  TESTPAD-20MIL  [20MIL]  39.37,92.71 90 top
U$17  TESTPAD-20MIL  [20MIL]  41.27,92.71 90 top
U$18  TESTPAD-20MIL  [20MIL]  43.18,92.71 90 top
U$19  TESTPAD-20MIL  [20MIL]  45.09,92.71 90 top
U$20  TESTPAD-20MIL  [20MIL]  46.99,92.71 90 top
U$21  TESTPAD-20MIL  [20MIL]  48.9,92.71 90 top
U$22  TESTPAD-20MIL  [20MIL]  50.8,92.71 90 top
U$23  TESTPAD-20MIL  [20MIL]  52.7,92.71 90 top
U$24  TESTPAD-20MIL  [20MIL]  52.7,106.68 90 top
U$25  TESTPAD-20MIL  [20MIL]  50.8,106.68 90 top
U$26  TESTPAD-20MIL  [20MIL]  48.9,106.68 90 top
U$27  TESTPAD-20MIL  [20MIL]  46.99,106.68 90 top
U$28  TESTPAD-20MIL  [20MIL]  45.09,106.68 90 top
U$29  TESTPAD-20MIL  [20MIL]  43.18,106.68 90 top
U$30  TESTPAD-20MIL  [20MIL]  41.27,106.68 90 top
U$31  TESTPAD-20MIL  [20MIL]  39.37,106.68 90 top
U$32  TESTPAD-20MIL  [20MIL]  37.47,106.68 90 top
U$33  TESTPAD-20MIL  [20MIL]  35.56,106.68 90 top
V+1  PTR1PAD1-13  [P1-13]  124.46,88.27 0 top
V+2  PTR1PAD1-13  [P1-13]  125.09,46.99 0 top
V+3  PTR1PAD1-13  [P1-13]  124.46,3.81 0 top
V-1  PTR1PAD1-13  [P1-13]  128.91,88.27 0 top
V-2  PTR1PAD1-13  [P1-13]  128.91,46.99 0 top
V-3  PTR1PAD1-13  [P1-13]  128.91,3.81 0 top
VREG1  TESTPAD-20MIL  [20MIL]  119.38,88.27 0 top
VREG2  TESTPAD-20MIL  [20MIL]  119.38,46.99 0 top
VREG3  TESTPAD-20MIL  [20MIL]  119.38,3.81 0 top

## Tracks (layer width: path | path; a pad name or v marks a point on that pad's centre or on a via)
12V
  Top 0.254: 31.19,24.93 29.96,26.16 23.19,26.16 | 32.69,25.75 31.87,24.93 31.19,24.93 | 32.69,25.75 | 32.69,25.75 37.17,25.75 | 32.69,25.75 32.69,31.2 C50.1 33.92,32.33 34.72,31.53 34.72,31.36 U$7.1 | IC3.3 31.19,24.93 | 12V.4 15.61,25.86 15.91,26.16 23.19,26.16 | C51.1 23.19,26.16 | R169.2 65.27,11.84 65.27,12.4 62.57,15.1 46.98,15.1 42.67,19.41 IC2.1 40.9,19.41 37.17,23.13 37.17,25.75 | 37.17,25.75 38.41,25.75 C53.1
+3V3  (via drill 0.46 pad 0.86)
  Top 0.254: v33.54,77.51 34.14,78.11 R1.2 34.14,81.24 33.51,81.86 33.51,91.03 33.16,91.39 33.16,100.05 36.09,102.99 U$2.28 34.68,105.84 34.68,107.03 37.34,109.69 37.62,109.69 R52.1 37.62,111.95 37.05,111.95 36.35,112.65 36.35,114.6 38.61,116.86 42.93,116.86 45.54,119.47 45.54,121.59 46.37,122.42 47.48,122.42 PROGRAM.5 49.35,118.69 50.16,118.69 60.59,108.26 U$3.1 60.59,106.95 60.59,106.61 | C48.1 62.32,106.25 62.28,106.28 60.59,106.28 | 60.59,106.61 57.38,106.61 57.06,106.3 C16.1 55.83,105.17 51.33,100.67 U$2.13 | 60.59,106.28 60.59,106.61 | U$3.4 60.59,106.28 | 28.96,21.42 28.91,21.47 IC3.2 | 28.96,21.42 33.07,21.42 34.59,22.95 C52.1 | 28.96,21.42 28.96,20.27 U$12.P$1
  Bottom 0.254: v33.54,77.51 29.02,72.99 29.02,20.33 28.96,20.27 U$12.P$1
+5V  (via drill 0.46 pad 0.86)
  Top 0.254: 74.57,23.23 v74.57,22.87 | 78.3,26.95 74.57,23.23 | v56.88,27.59 70.21,27.59 74.57,23.23 | 78.17,63.78 77.94,63.78 v77.2,64.53 | 78.3,26.95 78.17,27.08 78.17,63.78 | IC2_\.7 78.17,63.78 | IC2_\.1 80.18,71.4 79,72.58 v79,73.22 78.98,73.24 78.98,100.05 81.03,102.1 81.03,103.91 IC1.7 78.17,103.91 78.17,109.51 78.29,109.63 80.91,109.63 81.03,109.75 81.03,111.53 IC1.1 | AIN4.2 39.62,37.36 43.94,33.04 U$13.P$1 47.79,31.11 52.34,26.57 52.34,24.6 51.67,23.94 51.1,23.94 C54.1 49.87,22.81 49.87,22.05 47.23,19.41 IC2.2 | 26.14,76.2 26.14,72.64 26.19,72.6 26.19,63.81 27.46,62.53 U$1.16 | 13.72,88.15 11.71,86.14 11.71,85.16 20.66,76.2 26.14,76.2 | 26.14,76.2 27.28,76.2 27.77,75.71 27.77,75.04 27.48,74.76 27.48,73.86 U$6.16 | 13.72,88.15 13.72,88.1 15.69,90.08 15.69,94.22 13.06,96.86 13.06,106.67 18.79,112.39 21.29,112.39 U$4.8 | AIN0.2 13.72,88.15 | IC3_.7 78.3,19.33 77.75,19.88 v77.11,19.88 | IC3_.1 78.3,26.95
  Bottom 0.254: v79,73.22 76.74,70.96 76.74,64.99 v77.2,64.53 | U$13.P$1 53.36,31.11 v56.88,27.59 | v74.57,22.87 74.57,22.42 v77.11,19.88 | 11.75,62.79 11.75,52.13 12.64,51.24 13.72,51.24 AIN3.2 13.72,48.94 12.64,48.94 11.64,47.95 11.64,39.41 12.54,38.51 13.61,38.51 AIN4.2 | 11.75,62.79 11.75,73.45 12.64,74.34 13.72,74.34 AIN1.2 13.72,76.64 14.79,76.64 15.73,77.58 15.73,86.1 14.79,87.04 13.72,87.04 AIN0.2 | AIN2.2 11.75,62.79
ADC_CS  (via drill 0.46 pad 0.86)
  Top 0.254: v34.28,104.67 32.62,103.01 32.62,91.2 32.72,91.1 32.72,68.37 30.6,66.24 30.34,66.24 U$6.10 | U$2.26 38.63,105.85 38.5,105.98 38.5,106.83 37.8,107.53 37.04,107.53 36.4,106.89 36.4,106.68 U$33.P$1
  Bottom 0.254: U$33.P$1 35.56,105.84 35.45,105.84 v34.28,104.67
ADC_MISO  (via drill 0.46 pad 0.86)
  Top 0.254: v26.95,75.38 26.95,69.31 27.48,68.78 U$6.12 | U$26.P$1 49.73,106.68 49.73,106.18 50.06,105.85 U$2.17
  Bottom 0.254: U$26.P$1 48.9,105.84 40.38,97.32 40.38,92.25 40.76,91.87 40.76,87.04 29.1,75.38 v26.95,75.38
AGND  (via drill 0.46 pad 0.86)
  Top 0.203: 141,67.25 C27.2 C28.2 C29.2 | C26.2 141,67.25 | v136.33,67.28 136.36,67.25 141,67.25 | C25.2 147.82,62.87 148.23,62.45 148.23,60.39 148.11,60.26 142.29,60.26 142.1,60.07 141.25,60.07 | 128.91,47.45 139,47.45 139.89,48.34 139.89,48.9 C19.2 142.1,48.9 143.31,47.69 147.99,47.69 148.34,48.03 | 128.91,47.45 128.91,48.37 128.86,48.37 126.56,50.67 C31.2 125.45,53.23 125.48,53.25 C32.2 | V-2.TP 128.91,47.45 | 148.34,48.03 148.34,50.51 147.99,50.86 | 166.13,49.08 164.85,50.35 155.74,50.35 153.07,47.69 148.68,47.69 148.34,48.03 | 147.99,50.86 142.94,50.86 142.1,51.69 C20.2 | 141.53,54.48 142.29,53.72 147.64,53.72 148.23,53.14 148.23,51.09 147.99,50.86 | 166.13,49.08 166.74,49.08 167.35,49.69 167.35,49.73 D30.A D29.A 172.03,49.73 172.23,49.53 D28.A 173.43,48.52 175.7,46.25 175.7,45.37 176.94,44.13 184.61,44.13 185,44.53 185,45.35 185.37,45.72 185.37,48.81 186.86,50.31 188.43,50.31 188.86,50.74 188.86,81.85 188.47,82.24 187.83,82.24 L29.2 | C30.2 166.13,49.08 | 141.53,54.48 141.53,55.55 141,56.07 C23.2 141,58.48 141.25,58.73 141.25,60.07 | 104.14,68.42 115.51,68.42 118.44,65.48 119.88,65.48 | C21.2 141.53,54.48 | LTC2.P$27 120.72,69.48 119.88,69.48 | 119.88,69.48 119.51,69.48 111.68,77.31 111.68,79.02 108.97,81.74 107.37,81.74 101.05,75.41 101.05,74.41 | 119.88,69.48 119.88,68.98 LTC2.P$28 LTC2.P$29 LTC2.P$30 | 119.88,65.48 119.88,65.16 120.06,64.98 120.35,64.98 LTC2.P$36 | LTC2.P$35 119.88,65.48 | 90.21,72.01 90.21,70.13 IC2_\.15 | 101.05,74.41 92.61,74.41 90.21,72.01 | 90.21,72.01 87.32,72.01 86.92,71.6 86.92,62.99 87.4,62.51 IC2_\.9 | 101.05,74.41 103.07,72.39 U$9.1 U$9.4 104.14,68.42
  Top 0.203: C24.2 141.25,60.07 | 104.14,68.42 U$9.7 U$9.10 U$9.13
  Bottom 0.203: U$9.13 104.14,61.16 104.48,61.16 105.52,60.12 | 105.52,60.12 105.21,59.8 105.21,59.69 U$9.16 | 118.59,60.76 106.16,60.76 105.52,60.12 | 118.59,60.76 118.59,60.81 125.36,67.59 133.86,67.59 134.02,67.75 135.86,67.75 v136.33,67.28 | 118.59,60.76 118.59,55.92 127.52,46.99 V-2.TP
  pour Bottom: 85.72,43.81 85.72,84.45 189.23,84.45 189.23,43.81
  pour Top: 85.72,43.81 85.72,84.45 189.23,84.45 189.23,43.81
CELL0
  Top 0.254: GND-10.1 203.01,118.62 198.36,123.27 L17.1 L16.1
CELL1
  Top 0.254: L14.1 191.76,120.09 195.77,116.08 GND-10.2
CELL2
  Top 0.254: L13.1 191.76,116.92 195.14,113.54 GND-10.3
CELL3
  Top 0.254: L12.1 191.76,113.74 194.5,111 GND-10.4
CELL4
  Top 0.254: L11.1 191.76,110.57 193.87,108.46 GND-10.5
CELL5
  Top 0.254: GND-10.6 203.01,105.92 201.54,107.39 L10.1
CELL6
  Top 0.254: GND-10.7 203.01,103.38 202.17,104.22 L9.1
CELL7
  Top 0.254: GND-10.8 203.01,100.84 202.81,101.04 L8.1
CELL8
  Top 0.254: GND-10.9 203.01,98.3 202.58,97.87 L7.1
CELL9
  Top 0.254: GND-10.10 203.01,95.76 201.94,94.69 L6.1
CELL10
  Top 0.254: L30.1 190.55,82.03 190.63,82.1 L29.1 190.63,85.07 190.55,85.15 L15.1 190.55,90.01 190.63,90.09 190.63,90.8 | GND-10.11 203.01,93.22 200.59,90.8 190.63,90.8 | L5.1 190.63,90.8
CELL11
  Top 0.254: CELLS-11-20.1 203.01,75.44 201.03,77.42 L27.1
CELL12
  Top 0.254: CELLS-11-20.2 203.01,72.9 201.66,74.24 L26.1
CELL13
  Top 0.254: CELLS-11-20.3 203.01,70.36 202.3,71.07 L25.1
CELL14
  Top 0.254: CELLS-11-20.4 203.01,67.82 202.93,67.89 L24.1
CELL15
  Top 0.254: CELLS-11-20.5 203.01,65.28 202.45,64.72 L23.1
CELL16
  Top 0.254: CELLS-11-20.6 203.01,62.74 201.81,61.54 L22.1
CELL17
  Top 0.254: CELLS-11-20.7 203.01,60.2 201.18,58.37 L21.1
CELL18
  Top 0.254: CELLS-11-20.8 203.01,57.66 200.55,55.19 L20.1
CELL19
  Top 0.254: CELLS-11-20.9 203.01,55.12 202.53,54.64 193.74,54.64 191.68,52.58 191.68,52.02 L19.1
CELL20
  Top 0.254: L45.1 L44.1 190.58,44.21 190.55,44.24 L28.1 L18.1 199.28,48.84 203.01,52.58 CELLS-11-20.10
CELL21
  Top 0.254: CELLS-21-30.1 203.64,32.26 200.77,35.13 L42.1
CELL22
  Top 0.254: L41.1 191.71,31.95 193.94,29.72 CELLS-21-30.2
CELL23
  Top 0.254: CELLS-21-30.3 203.64,27.18 202.04,28.78 L40.1
CELL24
  Top 0.254: CELLS-21-30.4 203.64,24.64 202.68,25.6 L39.1
CELL25
  Top 0.254: CELLS-21-30.5 203.64,22.1 203.31,22.43 L38.1
CELL26
  Top 0.254: CELLS-21-30.6 203.64,19.56 203.34,19.25 L37.1
CELL27
  Top 0.254: CELLS-21-30.7 203.64,17.02 202.7,16.08 L36.1
CELL28
  Top 0.254: CELLS-21-30.8 203.64,14.48 202.07,12.9 L35.1
CELL29
  Top 0.254: CELLS-21-30.9 203.64,11.94 201.44,9.73 L34.1
CELL30
  Top 0.254: CELLS-21-30.10 203.64,9.4 200.8,6.55 L33.1 L43.1
CRITICAL
  Top 0.254: R156.2 32.63,40.89 46.99,55.26 46.99,91.87 U$20.P$1 46.99,93.13 46.99,93.55 47.23,93.79 47.52,93.79 U$2.10
DI-RO  (via drill 0.46 pad 0.86)
  Top 0.254: v39.95,90.7 44.27,90.7 45.95,92.38 45.95,93.5 45.62,93.83 45.62,96.78 46,97.16 49.55,97.16 50.06,96.65 U$2.12 50.06,93.79 50.56,93.79 50.8,93.55 U$22.P$1
  Bottom 0.254: v39.95,90.7 38.24,90.7 36.51,92.43 36.51,93 34.43,95.08 28.45,95.08 24.29,99.25 24.29,100.14 25.29,101.14 25.4,101.14 U$5.8
FAULT
  Top 0.254: U$2.22 43.71,105.85 43.18,106.39 U$29.P$1
  Bottom 0.254: U$5.2 25.4,106.22 25.29,106.22 24.3,105.24 24.3,104.26 24.88,103.68 39.55,103.68 42.34,106.47 42.34,106.68 U$29.P$1
GND  (via drill 0.46 pad 0.86)
  Top 0.203: IC1.9 87.4,102.64 87.4,108.19 87.59,108.39 90.09,108.39 90.21,108.5 90.21,110.26 | 90.21,110.26 90.09,110.26 IC1.15 | 90.21,110.26 | C6.2 142.15,98.42 142.34,98.23 147.4,98.23 148.32,97.31 148.32,95.24 147.78,94.69 | 147.78,94.69 143.09,94.69 142.15,95.63 C5.2 | 148.33,91.76 148.33,94.14 147.78,94.69 | 148.33,91.76 143.23,91.76 142.15,92.84 C4.2 140.83,92.84 139.94,92.84 139.94,92.28 136.62,88.96 128.91,88.96 V-1.TP | 165.61,92.55 165.01,93.15 154.63,93.15 153.23,91.76 148.33,91.76 | 165.61,92.55 167.5,92.55 167.52,92.53 D18.A D17.A 172.46,92.53 172.66,92.33 D16.A 173.86,91.32 176.26,88.93 176.26,88.46 176.88,87.83 184.89,87.83 187.17,90.11 188.77,90.11 188.94,90.27 188.94,126.44 L16.2 | C7.2 142.15,101.22 142.24,101.31 148.1,101.31 148.32,101.53 148.32,103.69 147.84,104.17 141.05,104.17 | 125.25,94.5 C2.2 | 125.25,94.5 125.25,95.31 125.22,95.34 C15.2 125.22,107.11 123.35,108.99 | v125.43,94.5 125.25,94.5 | C11.2 141.05,111.19 | C12.2 139.94,115.19 139.94,115.74 | C8.2 141.05,104.17 | 141.05,104.17 141.05,104.21 141.05,105.22 140.98,105.22 139.94,106.25 | 105.36,108.21 105.21,108.06 105.21,107.95 U$8.7 U$8.10 U$8.13 U$8.16 | 119.68,105.74 118.56,105.74 115.23,109.06 106.21,109.06 105.36,108.21 | 105.36,108.21 104.14,109.42 U$8.4 104.14,110.62 | 90.21,110.26 90.57,110.62 104.14,110.62 | C14.2 165.61,92.55 | 141.05,111.19 C10.2 | 141.05,111.19 137.32,111.19 136.81,111.71 134.07,111.71 133.69,111.33 132.72,111.33 v132.32,110.94 | 139.94,106.25 139.94,106.81 C9.2 | v136.08,106.2 136.68,105.6 139.29,105.6 139.94,106.25 | 123.35,108.99 130.4,116.05 134.03,116.05 134.23,115.85 135.74,115.85 136.29,116.39 139.29,116.39 139.94,115.74
  Top 0.203: 139.94,115.74 140.98,116.78 141.05,116.78 C13.2 | LTC1.P$30 119.68,108.24 119.68,108.74 LTC1.P$29 121.07,108.74 121.07,109.24 | 121.54,109.42 121.54,109.74 LTC1.P$27 | 121.07,109.24 121.36,109.24 121.54,109.42 | 123.35,108.99 121.97,108.99 121.54,109.42 | LTC1.P$28 121.07,109.24 | 119.68,105.74 119.68,105.24 LTC1.P$36 | LTC1.P$35 119.68,105.74 | 104.14,110.62 U$8.1
  Bottom 0.203: 128.21,94.5 128.21,100 133.6,105.39 | 128.21,88.27 128.21,94.5 | 128.21,94.5 v125.43,94.5 | 133.6,105.39 134.42,106.2 v136.08,106.2 | v132.32,110.94 132.32,106.67 133.6,105.39 | 128.21,88.27 127.52,88.27 126.12,86.86 118.54,86.86 105.21,100.2 105.21,100.33 U$8.16 | V-1.TP 128.21,88.27
  pour Top: 85.72,86.36 85.72,129.54 189.23,129.54 189.23,86.36
  pour Bottom: 85.72,86.36 85.72,129.54 189.23,129.54 189.23,86.36
GNDIO  (via drill 0.46 pad 0.86)
  Top 0.254: 47.52,102.99 44.98,100.45 U$2.8 | 51.85,109.1 51.85,106.33 51.96,106.22 51.96,103.1 51.85,102.99 47.52,102.99 | 50.93,109.86 51.09,109.86 51.85,109.1 | 51.85,109.1 54.6,109.1 C16.2 57.06,109.1 57.89,108.26 58.49,108.26 U$3.2 | U$2.19 47.52,102.99 | C22.2 50.93,109.86 | 50.93,109.86 50.93,112.44 C1.2 50.93,115.69 v49.9,116.73 | 34.34,35.13 35.77,36.56 39.38,36.56 40.31,35.63 C49.2 | 30.98,71.43 32.2,70.2 32.2,68.57 30.51,66.87 27.6,66.87 27.48,66.75 27.48,64.97 U$6.9 30.2,64.97 30.32,64.97 | 30.98,71.43 30.88,71.32 30.34,71.32 U$6.14 | 30.98,71.43 31.82,72.27 31.82,72.98 27.3,77.5 27.3,79.78 26.47,80.62 23.77,80.62 S2.1 23.77,85.65 | 39.99,26.71 39.99,26.28 38.92,25.21 38.41,25.21 C53.2 | 36.5,29.79 37.7,29.79 39.99,27.5 39.99,26.71 | 39.99,26.71 41.09,26.71 IC2.3 48.77,26.71 49.87,25.61 C54.2 | 77.39,18.06 76.3,19.14 76.3,23.68 78.3,25.68 IC3_.2 81.16,25.68 81.16,39.93 79.6,41.49 IC2_\.8 | 77.39,18.06 78.3,18.06 IC3_.8 | 63.31,4.38 63.94,4.38 64.34,4.78 64.34,5.02 77.39,18.06 | 30.32,64.97 30.32,59.56 30.13,59.36 27.62,59.36 26.37,58.11 26.37,54.9 25.12,53.65 U$1.8 22.26,53.65 22.26,47.55 | 30.32,64.97 30.34,64.97 35.27,69.9 35.27,81.06 34.04,82.28 34.04,91.22 33.67,91.59 33.67,99.3 37.36,102.99 U$2.27 | 78.17,102.64 78.17,70.13 IC2_\.2 | 34.34,35.13 C50.2 15.89,35.13 15.58,34.82 AIN4.1 13.61,33.67 11.66,31.72 11.66,20.31 13.73,18.24 13.87,18.24 | 34.34,35.13 34.34,34.89 35.67,33.56 U$7.3 36.5,29.79 | 51.89,121.48 50.44,122.93 49.17,122.93 48.66,123.44 45.12,123.44 44.61,122.93 40.68,122.93 40.17,122.42 32.21,122.42 25.07,115.28 | 25.07,115.28 26.49,113.87 26.49,93.55 23.77,90.83 S2.2 23.77,85.65
  Top 0.254: 25.07,115.28 24.15,116.2 U$4.5 | LED38.C LED37.C LED40.C 22.61,47.05 22.26,47.4 22.26,47.55 | 36.5,29.79 36.38,29.79 34.59,28.01 C52.2 | 23.65,23.92 25.21,23.92 25.54,23.6 IC3.1 26.67,23.55 26.67,20.5 28.57,18.59 37.49,18.59 48.84,7.24 58.98,7.24 59.05,7.16 | 13.87,18.24 17.97,18.24 23.65,23.92 | AIN2.1 13.72,61.4 12.64,61.4 11.74,62.29 11.74,69.83 13.72,71.8 AIN1.1 | 76.08,108.28 76.08,104.73 78.17,102.64 | 76.08,108.28 78.07,110.26 IC1.2 | 76.08,108.28 65.55,108.28 64.78,109.05 C48.2 63.55,110.17 63.19,110.17 51.89,121.48 | PROGRAM.6 51.89,121.48 | 22.26,47.55 15.69,47.55 AIN3.1 | T1.2 63.31,4.38 | 13.87,18.24 12V.1 | IC1.8 78.17,102.64 | C51.2 23.65,23.92 | 23.77,85.65 15.69,85.65 AIN0.1 | 59.05,7.16 60.27,8.38 60.27,8.99 R2.1 | 59.05,7.16 59.05,5.26 59.89,4.42 63.25,4.42 63.31,4.38
  Bottom 0.254: AIN3.1 13.72,46.4 15.62,44.49 15.62,36.9 14.69,35.97 13.61,35.97 AIN4.1 | PROGRAM.6 51.89,118.69 51.86,118.69 v49.9,116.73 | S2.1 23.77,80.62 21.39,80.62 AIN1.1
  other vias: 40.64,69.22 35.56,55.88 36.2,87.63 73.66,96.52 19.05,114.3 30.48,97.79 45.72,100.33 40.01,115.57 19.68,110.49 81.28,80.01 82.55,33.66
  pour Top: 0.64,130.18 84.45,130.18 84.45,0.64 0.64,0.64
  pour Bottom: 0.64,130.18 84.45,130.18 84.45,0.64 0.64,0.64
JACK2
  Top 0.254: U$5.1 21.77,107.31 20.62,106.17 J20.2
  Bottom 0.254: J20.2 13.06,107.21 13.06,122.92 J19.2
JACK3
  Top 0.254: J19.3 21.6,122.68 21.75,122.83 R170.1 22.99,121.7 23.55,121.7 24.22,121.04 24.22,118.99 22.61,117.39 22.04,117.39 21.29,116.64 21.29,114.94 U$4.6 | J20.3 21.64,104.9 21.77,104.78 U$5.4
  Bottom 0.254: U$5.4 22.86,105.87 22.72,105.87 21.77,106.82 21.77,117.55 J19.3
JACK4
  Top 0.254: 22.86,103.23 22.46,103.63 J20.4 | 22.86,103.23 22.86,103.33 23,103.33 24.15,104.48 24.15,113.67 U$4.7 21.29,113.67 20.78,114.18 20.78,116.93 | U$5.7 22.86,103.23 | 20.78,116.93 22.7,118.86 22.99,118.86 R170.2 | 20.78,116.93 18.34,116.93 14.1,121.17 J19.4
JACK5
  Bottom 0.254: 17.87,103.59 17.87,118.91 J19.5 | J20.5 17.87,103.59 | 17.87,103.59 21.77,99.69 U$5.10
LED2  (via drill 0.46 pad 0.86)
  Top 0.254: v28.21,51.83 31.5,48.54 R158.2
  Bottom 0.254: SV1.3 23.5,56.54 v28.21,51.83
LTC_1_CS  (via drill 0.46 pad 0.86)
  Top 0.254: v49.52,111.78 49.4,111.9 40.17,111.9 40.02,111.75 40.02,108.78 41.27,107.52 U$30.P$1 41.69,106.68 42.11,106.68 42.11,106.18 42.44,105.85 U$2.23 | IC1.5 81.03,106.45 82.12,105.36 82.12,101.61 80,99.49 80,94.13 81.92,92.22 CS1_O.TP
  Bottom 0.254: CS1_O.TP 81.92,92.22 83.35,93.64 83.35,99.02 70.58,111.78 v49.52,111.78
LTC_1_MISO
  Top 0.254: IC1.6 81.03,105.18 81.56,104.65 81.56,101.78 79.49,99.7 79.49,90.83 81.92,88.41 MISO1_O.TP | U$23.P$1 52.7,93.55 52.6,93.65 U$2.14
  Bottom 0.254: MISO1_O.TP 80.5,87 74.79,92.71 U$23.P$1
LTC_2_CS  (via drill 0.46 pad 0.86)
  Top 0.254: v44.3,81.7 44.3,82.76 34.69,92.37 34.69,96.5 41.17,102.99 U$2.24 41.17,105.09 39.58,106.68 U$31.P$1 | v77.56,66.84 77.65,66.84 78.17,66.32 IC2_\.5
  Bottom 0.254: 78.03,64.21 78.78,64.21 84.01,58.98 84.01,53.67 82.55,52.21 CS2_O.TP | v77.56,66.84 78.03,66.36 78.03,64.21 | v44.3,81.7 62.31,63.7 77.52,63.7 78.03,64.21
LTC_2_MISO  (via drill 0.46 pad 0.86)
  Top 0.254: v55.03,99.67 55.03,88.19 78.17,65.05 79.01,65.05 IC2_\.6 81.03,65.05 81.03,60.29 80.59,59.85 80.59,50.36 82.55,48.4 MISO2_O.TP | U$24.P$1 52.7,105.84 52.6,105.74 U$2.15
  Bottom 0.254: U$24.P$1 52.7,105.84 55.03,103.52 v55.03,99.67
LTC_3_CS  (via drill 0.46 pad 0.86)
  Top 0.254: 38.2,102.99 34.18,98.97 34.18,91.8 34.56,91.42 34.56,82.49 35.78,81.27 35.78,74.76 v37.01,73.52 | v77.67,22.23 77.94,22.23 78.3,21.87 IC3_.5 | 38.2,102.99 37.99,103.19 37.99,106.15 U$32.P$1 | 38.2,102.99 39.9,102.99 U$2.25
  Bottom 0.254: v37.01,73.52 37.01,62.89 v77.67,22.23 78.83,21.07 78.83,10.84 82.55,7.12 CS3_O.TP
LTC_3_MISO
  Top 0.254: U$2.16 51.33,105.85 50.8,106.39 U$25.P$1 | IC3_.6 81.16,20.6 81.16,15.1 80.59,14.53 80.59,5.28 82.55,3.31 MISO3_O.TP
  Bottom 0.254: U$25.P$1 50.8,101.52 42.31,93.03 42.31,83.26 33.62,74.56 33.62,73.96 30.07,70.42 30.07,55.79 82.55,3.31 MISO3_O.TP
MCLR
  Top 0.254: 45.95,117.08 46.81,117.94 46.81,118.69 PROGRAM.4 | 45.95,117.08 42.48,113.61 R53.1 38.9,113.61 38.85,113.67 R52.2 | 45.95,117.08 48.13,114.89 C1.1
MOSI  (via drill 0.46 pad 0.86)
  Top 0.254: IC1.4 81.03,107.72 82.64,106.12 82.64,101.17 80.5,99.03 80.5,97.44 81.92,96.03 MOSI1_O.TP 81.92,93.91 81.92,93.2 83.34,91.78 83.34,71.97 80.87,69.5 78.37,69.5 78.17,69.3 78.17,67.59 IC2_\.4 81.03,67.59 81.59,67.03 81.59,59.88 81.09,59.38 81.09,57.48 82.55,56.02 MOSI2_O.TP | U$6.11 30.34,67.51 30.34,67.86 v30.98,68.49 | U$2.6 42.44,93.79 42.94,93.79 43.18,93.55 U$18.P$1 | IC3_.4 81.16,23.14 81.69,22.6 81.69,14.77 81.09,14.17 81.09,12.39 82.55,10.94 MOSI3_O.TP
  Bottom 0.254: MOSI1_O.TP 51.46,94.61 49.85,93 49.85,88.64 35.32,74.11 35.32,72.62 31.75,69.06 30.98,69.06 | 30.98,69.06 30.58,69.46 30.58,70.2 34.13,73.75 34.13,74.35 44.02,84.24 44.02,92.71 U$18.P$1 | 30.98,69.06 v30.98,68.49 | MOSI2_O.TP 82.55,53.2 81.14,51.79 81.14,12.35 82.55,10.94 MOSI3_O.TP
N$1
  Top 0.254: R53.2 41.25,109.64 41.53,109.64 44.13,107.04 44.13,106.15 44.35,105.94 44.35,103.19 37.81,96.65 36.09,96.65 U$2.1
N$2
  Top 0.254: U$9.5 106.68,70.94 106.57,70.94 105.57,71.94 105.57,77.19 106.39,78.02 106.96,78.02 R104.2
N$3  (via drill 0.46 pad 0.86)
  Top 0.254: R1.1 36.98,81.24 36.95,81.24 v35.37,82.83 | S2.4 S2.3
  Bottom 0.254: SV1.1 28.57,80.59 28.55,80.62 28.3,80.62 S2.3 28.65,82.83 v35.37,82.83
N$4
  Top 0.254: T1.3 65.51,3.67 64.08,2.23 54.66,2.23 K1.2
N$5
  Top 0.254: R155.2 106.66,31.23 105.57,30.14 105.57,28.11 106.54,27.13 106.68,27.13 U$10.5
N$6
  Bottom 0.254: J20.1 16.64,118.59 15.57,119.66 15.57,124.16 J19.1
N$7
  pour Top: 10.79,10.79 10.79,3.17 36.83,3.17 36.83,13.97 19.05,13.97 19.05,10.79
  pour Bottom: 10.79,10.79 10.79,3.17 36.83,3.17 36.83,13.97 19.05,13.97 19.05,10.79
N$9
  Top 0.203: 128.24,101.74 128.24,98.84 133.43,93.65 LTC1_C10.P$1 C4.1 | 128.24,102.74 128.24,101.74 | LTC1.P$6 128.01,103.74 128.24,103.52 128.24,102.74 | LTC1.P$2 128.24,101.74 | LTC1.P$4 128.24,102.74
  Bottom 0.203: D6.C 158.68,92.91 157.4,91.63 140.1,91.63 139.31,92.42 139.31,92.84 R10.2 LTC1_C10.P$1
N$10
  Top 0.254: R5.2 106.7,116.95 105.58,115.82 105.58,112.55 106.54,111.58 106.68,111.58 U$8.5
N$11
  Top 0.203: R5.1 107.78,122.01 110.15,122.01 118.61,113.55 118.61,107.81 119.68,106.74 LTC1.P$33
N$12
  Top 0.203: U$8.11 107.75,105.41 107.75,105.3 108.81,104.24 LTC1.P$38
N$13
  Top 0.203: LTC1.P$39 119.68,103.74 117.4,103.74 115.45,101.8 108.69,101.8 107.75,102.74 107.75,102.87 U$8.14
N$14
  Top 0.203: LTC1.P$40 118.55,103.24 114.52,99.21 108.74,99.21 107.75,100.21 107.75,100.33 U$8.17
N$15
  Top 0.203: U$8.8 107.75,107.95 107.75,107.82 108.68,106.88 115.43,106.88 117.57,104.74 LTC1.P$37
N$18
  Bottom 0.254: J20.6 15.13,102.13 15.13,117.84 J19.6
N$20  (via drill 0.46 pad 0.86)
  Top 0.254: L5.2 186.7,91.52 185.92,92.3 v185.81,92.3 | v173.41,95.36 171.59,97.17 Q3.2
  Bottom 0.254: v185.81,92.3 182.75,95.36 v173.41,95.36 172.5,94.45 159.17,94.45 157.55,92.84 R10.1
N$21
  Top 0.203: IC1.12 92.82,106.45 93.87,105.41 CS1.TP 96.63,105.41 103.75,98.29 116.73,98.29 119.68,101.24 LTC1.P$44
N$23
  Top 0.203: 94.56,107.72 95.24,107.72 104.2,98.75 116.3,98.75 119.68,102.13 119.68,102.24 LTC1.P$42 | 94.56,107.72 94.56,109.22 SDI1.TP | 94.56,107.72 90.21,107.72 IC1.13
N$24  (via drill 0.46 pad 0.86)
  Top 0.203: v118.84,102.42 119.16,102.74 LTC1.P$41 | SCK1.TP 92.15,113.03 89.99,110.87 87.56,110.87 87.4,110.7 87.4,108.99 IC1.14
  Bottom 0.203: SCK1.TP 96.63,113.03 101.51,117.91 105.93,117.91 118.84,104.99 v118.84,102.42 | v118.84,102.42
N$25
  Top 0.203: R11.2 146.11,92.96 144.84,94.23 LTC1_S10.P$1 133.66,94.23 129.2,98.7 129.2,103.28 128.24,104.24 LTC1.P$7
N$26
  Top 0.254: Q3.1 170.37,96 169.97,96 169.02,96.95 155.18,96.95 151.19,92.96 R11.1
N$27
  Top 0.254: Q3.3 168.37,95.48 169.99,93.87 174.45,93.87 176.65,91.67 177.97,91.67 R12.2
N$28
  Bottom 1.27: 8.89,12.7 8.89,1.27 38.73,1.27 38.73,15.88 17.14,15.88 17.14,12.7 8.89,12.7
N$29  (via drill 0.46 pad 0.86)
  Top 0.254: v152.29,97.83 154.93,100.47 Q4.2 171.32,100.47 175.85,95.94 178.82,95.94 182.34,92.42 182.34,89.74 R12.1 184.8,89.74 184.8,92.79 186.7,94.69 L6.2
  Bottom 0.254: R14.1 150.1,95.63 v152.29,97.83
N$30
  Top 0.203: LTC1.P$31 121.54,107.74 122.49,106.79 122.49,97.82 122.42,97.75 C15.1
N$31
  Top 0.203: LTC1.P$8 128.24,104.74 128.38,104.74 129.84,103.28 129.84,100.03 133.43,96.44 133.43,96.01 LTC1_C9.P$1 C5.1
  Bottom 0.203: LTC1_C9.P$1 R14.2 139.31,95.63 139.31,95.22 140.1,94.42 154.1,94.42 155.13,95.45 D7.C 158.32,95.45 158.68,95.81 D6.A
N$32
  Top 1.27: 8.89,12.7 17.14,12.7 17.14,15.88 38.73,15.88 38.73,1.27 8.89,1.27 8.89,12.7
N$33  (via drill 0.46 pad 0.86)
  other vias: 197.44,91.91
  pour Top: 189.87,130.18 189.87,87 218.44,87 218.44,130.18
  pour Bottom: 189.87,130.18 189.87,87 218.44,87 218.44,130.18
N$34
  Top 0.203: R15.2 146.11,96.27 145.48,96.9 LTC1_S9.P$1 133.73,96.9 130.3,100.33 130.3,103.47 128.53,105.24 128.24,105.24 LTC1.P$9
N$35
  Top 0.254: Q4.1 169.59,98.57 154.21,98.57 151.91,96.27 151.19,96.27 R15.1
N$36
  Top 0.254: R16.2 176.74,93.8 171.03,99.52 Q4.3
N$37  (via drill 0.46 pad 0.86)
  other vias: 192.5,52.17
  pour Bottom: 189.87,85.09 218.44,85.09 218.44,44.45 189.87,44.45
  pour Top: 189.87,85.09 218.44,85.09 218.44,44.45 189.87,44.45
N$38  (via drill 0.46 pad 0.86)
  Top 0.254: v144.09,100.52 144.32,100.75 150.76,100.75 153.78,103.77 Q5.2 172.95,103.77 176.92,99.8 179.06,99.8 180.52,98.34 180.52,97.95 183.47,95 183.83,95 | 183.83,95 186.7,97.87 L7.2 | 183.83,95 183.83,94.03 184.06,93.8 R16.1
  Bottom 0.254: R18.1 142.18,98.42 142.18,98.61 v144.09,100.52
N$39  (via drill 0.46 pad 0.86)
  other vias: 196.31,2.86
  pour Top: 189.87,42.55 218.44,42.55 218.44,0.64 189.87,0.64
  pour Bottom: 189.87,42.55 218.44,42.55 218.44,0.64 189.87,0.64
N$40
  Top 0.203: LTC1.P$10 128.68,105.74 130.76,103.66 130.76,101.91 133.43,99.24 LTC1_C8.P$1 C6.1
  Bottom 0.203: LTC1_C8.P$1 R18.2 139.31,98.42 139.31,98.01 140.1,97.22 142.42,97.22 143.81,98.61 154.86,98.61 155.13,98.35 D7.A 158.53,98.35 158.68,98.5 D8.C
N$43
  Top 0.203: R19.2 146.11,99.44 145.83,99.72 135.66,99.72 135.56,99.82 LTC1_S8.P$1 133.66,99.82 131.22,102.27 131.22,103.85 128.82,106.24 128.24,106.24 LTC1.P$11
N$44
  Top 0.254: R19.1 151.19,99.44 153.62,101.87 Q5.1
N$45
  Top 0.254: R20.2 176.74,97.87 171.79,102.82 Q5.3
N$47  (via drill 0.46 pad 0.86)
  Top 0.254: Q6.2 173.38,104.06 178.83,104.06 182.34,100.55 182.34,97.87 R20.1 184.8,97.87 184.8,98.7 v185.77,99.67 185.77,100.11 186.7,101.04 L8.2
  Bottom 0.254: v185.77,99.67 186.64,98.8 186.64,91.98 185.8,91.14 133.88,91.14 132.57,92.44 132.57,101.6 134.31,103.33 135.1,103.33 137.07,101.36 137.07,101.22 R22.1
N$48
  Top 0.254: C22.1 46.9,109.86 46.15,109.1 46.15,105.96 46.25,105.85 U$2.20
N$49
  Top 0.203: LTC1.P$12 128.97,106.74 131.67,104.04 131.67,103.78 133.43,102.03 LTC1_C7.P$1 C7.1
  Bottom 0.203: LTC1_C7.P$1 136.07,101.22 137.28,100.01 139.15,100.01 139.94,100.81 139.94,101.22 R22.2 141.6,101.22 142.15,101.22 142.29,101.36 154.81,101.36 155.13,101.04 D9.C 158.32,101.04 158.68,101.4 D8.A
N$52
  Top 0.203: R23.2 135.64,102.62 135.51,102.49 LTC1_S7.P$1 133.8,102.49 132.13,104.16 132.13,104.23 129.12,107.24 LTC1.P$13
N$53
  Top 0.254: Q6.1 170.37,105.9 169.97,105.9 169.02,106.85 155.43,106.85 151.19,102.62 R23.1
N$54  (via drill 0.46 pad 0.86)
  Top 0.254: v168.52,104.74 168.37,104.89 Q6.3 | R24.2 176.07,101.93 v175.1,102.9
  Bottom 0.254: v175.1,102.9 173.26,104.74 v168.52,104.74
N$56  (via drill 0.46 pad 0.86)